# EAGLE schematic Lab10_Starter (EAGLE 9.6.2)
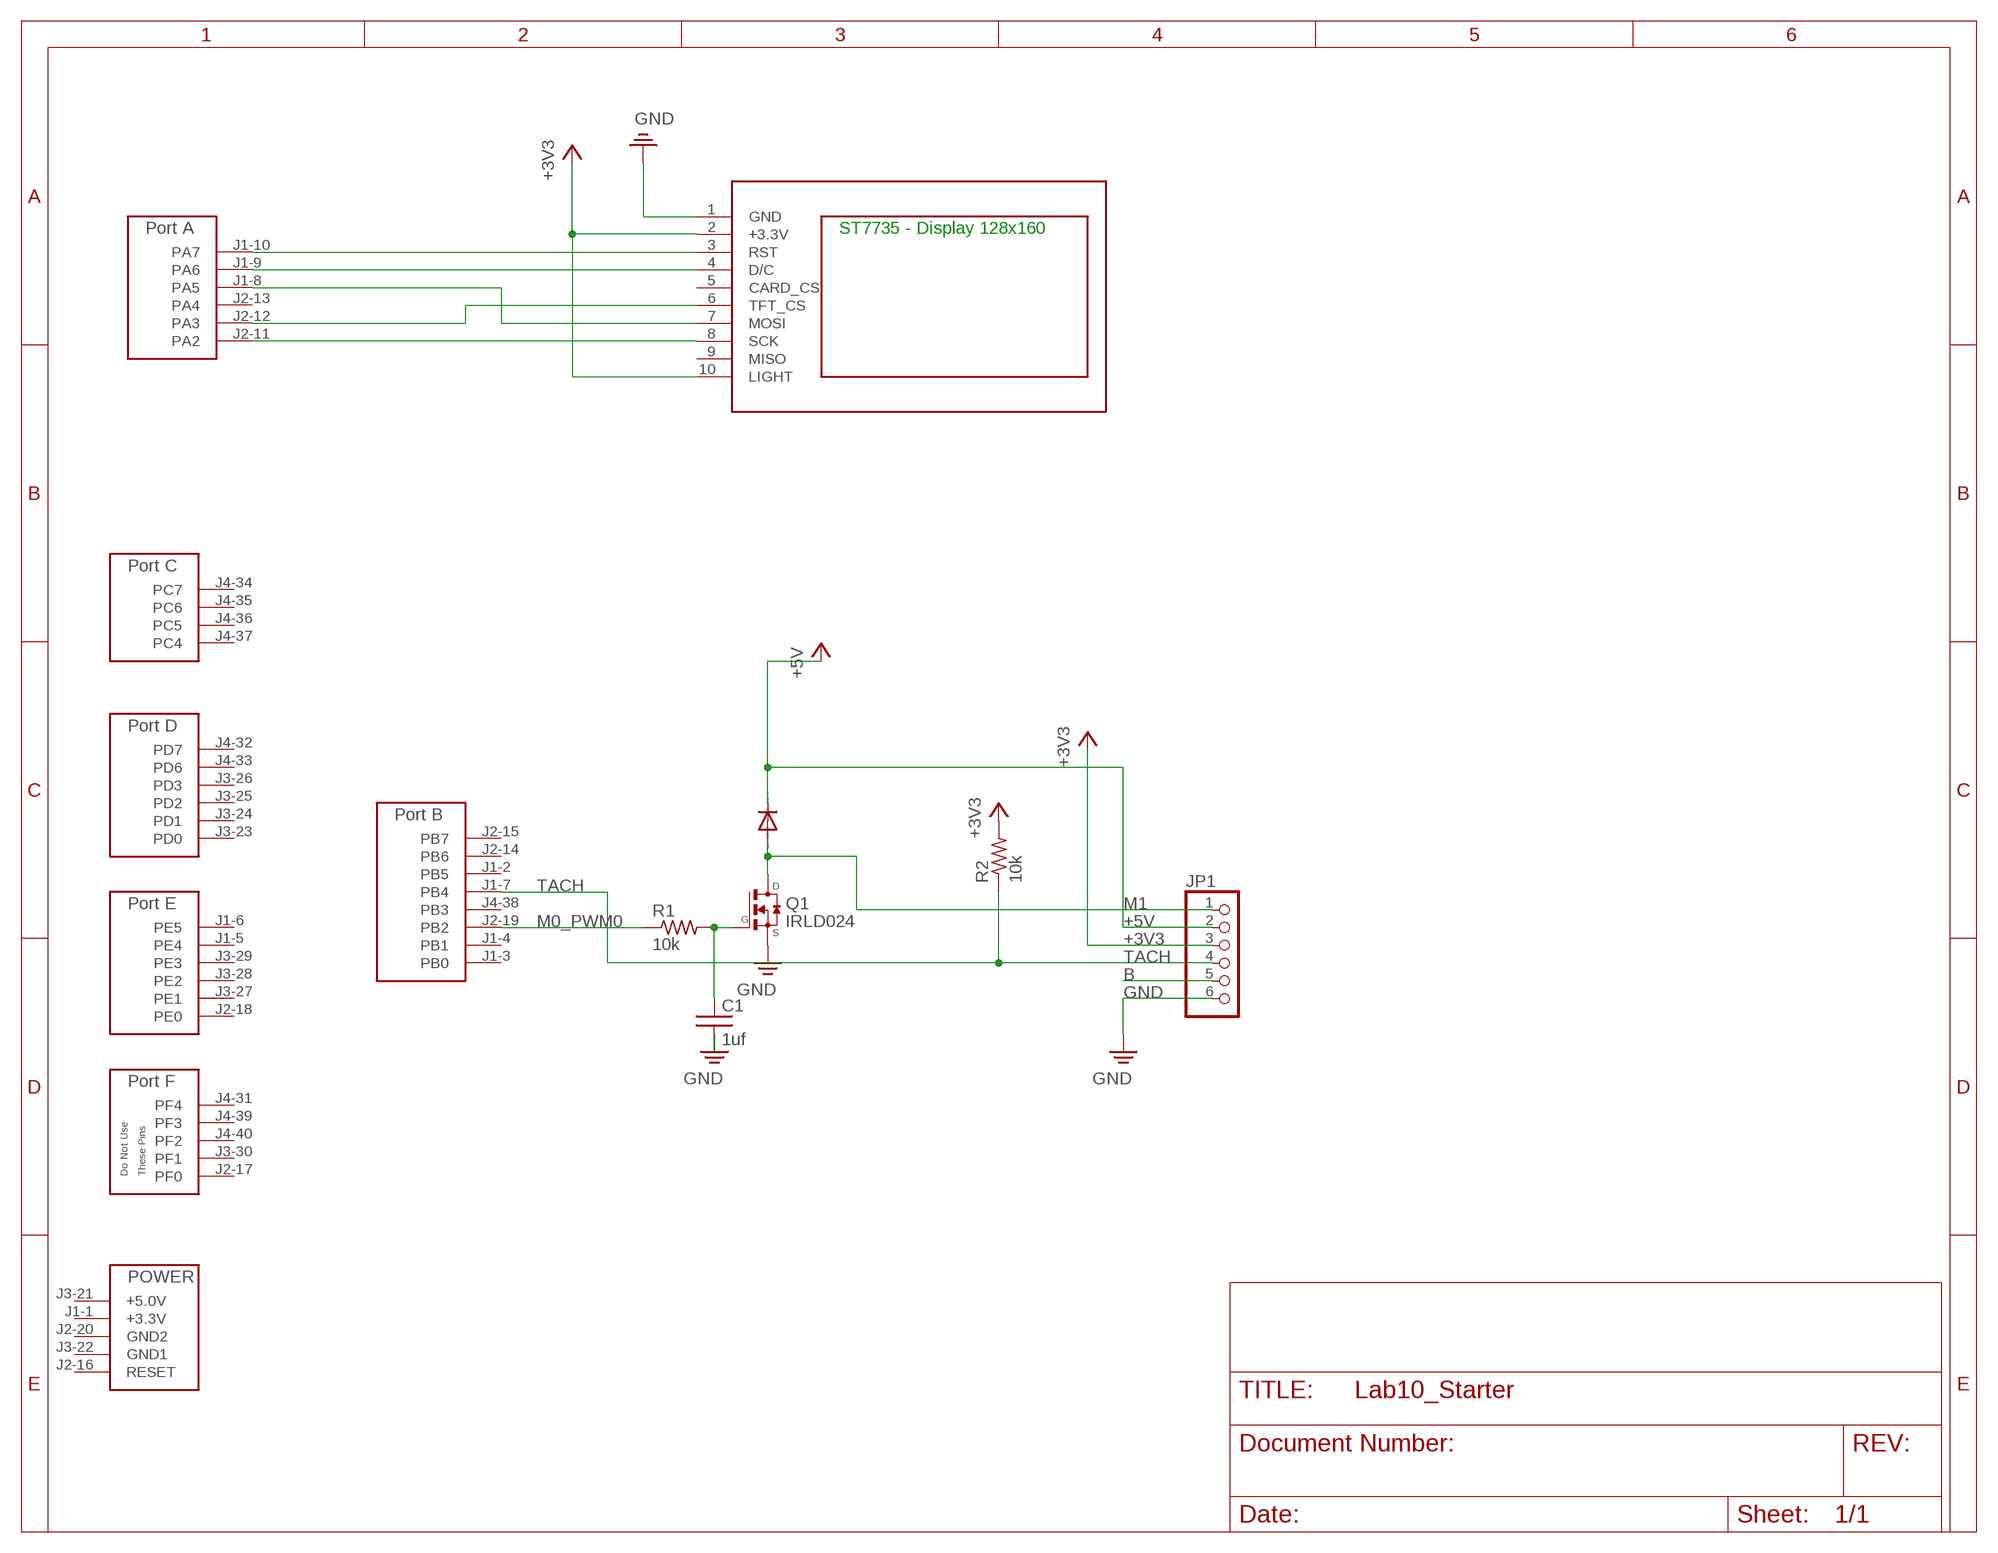
[diagram p0: schematic, sheet 1]

## Parts
C1  1uf  CAPACITOR050-024X044  [CAP200MIL]
D1  1N914DO35-7  [DO35-7]
JP1  PINHD-1X6  [1X06]
Q1  IRLD024  [IRLD024]
R1  10k  RESISTOR0204/5  [RES200MIL]
R2  10k  RESISTOR0204/5  [RES200MIL]
U$1  TM4C_BP  [TM4C_BOOSTER_PACK]
U$2  ST7735  [ST7735]
U$3  TM4C_BP  [TM4C_BOOSTER_PACK]

## Nets
+3V3: JP1.3 R2.2 U$2.2(+3.3V) U$2.10(LIGHT)
+5V: D1.C JP1.2
B: JP1.5
GND: C1.2 JP1.6 Q1.P$4(S) U$2.1(GND)
M0_PWM0: R1.1 U$1.J2-19(PB2)
M1: D1.A JP1.1 Q1.P$1(D)
N$1: U$2.3(RST) U$3.J1-10(PA7)
N$2: C1.1 Q1.P$3(G) R1.2
N$6: U$2.4(D/C) U$3.J1-9(PA6)
N$7: U$2.7(MOSI) U$3.J1-8(PA5)
N$8: U$2.6(TFT_CS) U$3.J2-12(PA3)
N$9: U$2.8(SCK) U$3.J2-11(PA2)
TACH: JP1.4 R2.1 U$1.J1-7(PB4)
Unconnected: U$1.J1-1(+3.3V) U$1.J1-2(PB5) U$1.J1-3(PB0) U$1.J1-4(PB1) U$1.J1-5(PE4) U$1.J1-6(PE5) U$1.J1-8(PA5) U$1.J1-9(PA6) U$1.J1-10(PA7) U$1.J2-11(PA2) U$1.J2-12(PA3) U$1.J2-13(PA4) U$1.J2-14(PB6) U$1.J2-15(PB7) U$1.J2-16(RESET) U$1.J2-17(PF0) U$1.J2-18(PE0) U$1.J2-20(GND2) U$1.J3-21(+5.0V) U$1.J3-22(GND1) U$1.J3-23(PD0) U$1.J3-24(PD1) U$1.J3-25(PD2) U$1.J3-26(PD3) U$1.J3-27(PE1) U$1.J3-28(PE2) U$1.J3-29(PE3) U$1.J3-30(PF1) U$1.J4-31(PF4) U$1.J4-32(PD7) U$1.J4-33(PD6) U$1.J4-34(PC7) U$1.J4-35(PC6) U$1.J4-36(PC5) U$1.J4-37(PC4) U$1.J4-38(PB3) U$1.J4-39(PF3) U$1.J4-40(PF2) U$2.5(CARD_CS) U$2.9(MISO) U$3.J1-1(+3.3V) U$3.J1-2(PB5) U$3.J1-3(PB0) U$3.J1-4(PB1) U$3.J1-5(PE4) U$3.J1-6(PE5) U$3.J1-7(PB4) U$3.J2-13(PA4) U$3.J2-14(PB6) U$3.J2-15(PB7) U$3.J2-16(RESET) U$3.J2-17(PF0) U$3.J2-18(PE0) U$3.J2-19(PB2) U$3.J2-20(GND2) U$3.J3-21(+5.0V) U$3.J3-22(GND1) U$3.J3-23(PD0) U$3.J3-24(PD1) U$3.J3-25(PD2) U$3.J3-26(PD3) U$3.J3-27(PE1) U$3.J3-28(PE2) U$3.J3-29(PE3) U$3.J3-30(PF1) U$3.J4-31(PF4) U$3.J4-32(PD7) U$3.J4-33(PD6) U$3.J4-34(PC7) U$3.J4-35(PC6) U$3.J4-36(PC5) U$3.J4-37(PC4) U$3.J4-38(PB3) U$3.J4-39(PF3) U$3.J4-40(PF2)

## Notes on the sheet
- ST7735 - Display 128x160

## Library data of the parts
C1 = EE445L:CAPACITOR: CAPACITOR, American symbol
D1 = EE445L:1N914: DIODE high speed (Philips) 1N914
JP1 = EE445L:PINHD-1X6: PIN HEADER
Q1 = EE445L:IRLD024: N-Channel Enhancement MOSFET
R1 R2 = EE445L:RESISTOR: RESISTOR, American symbol
U$1 U$3 = EE445L:TM4C_BP
U$2 = EE445L:ST7735